# Altium schematic sheet Analog.SchDoc
size A3
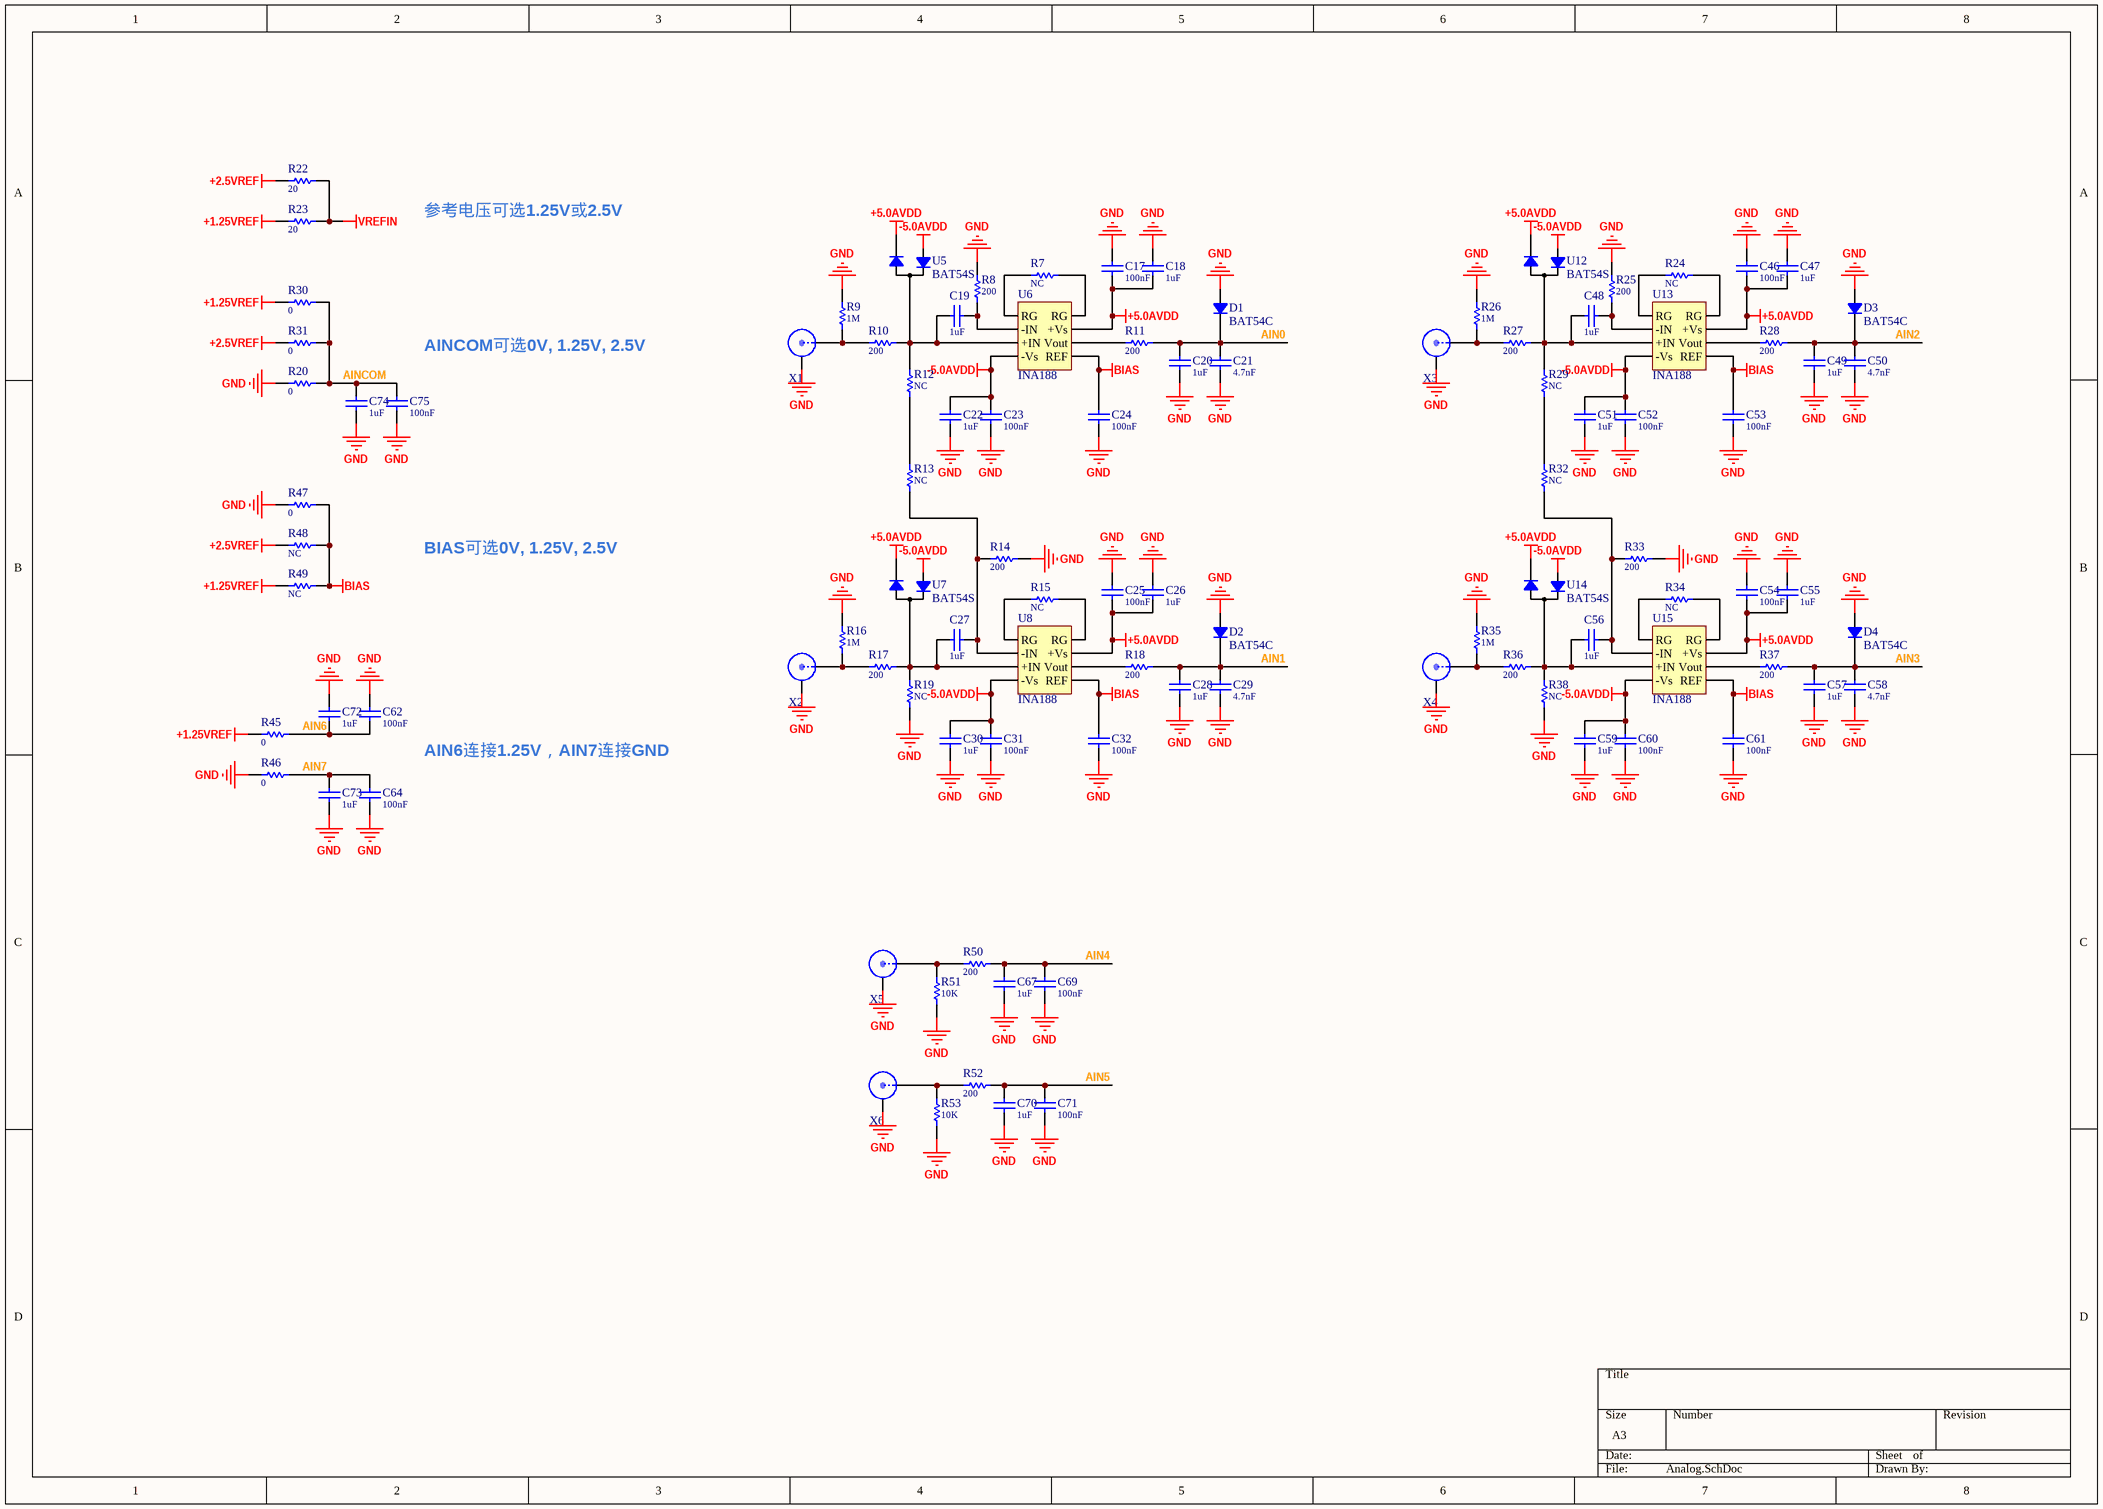
[diagram p0: Analog.SchDoc]

## Parts
C17  value 100nF  [C0402-L]  (hidden comment: Cap-S)
C18  value 1uF  [C0603-L]  (hidden comment: Cap-S)
C19  value 1uF  [C0603-L]  (hidden comment: Cap-S)
C20  value 1uF  [C0603-L]  (hidden comment: Cap-S)
C21  value 4.7nF  [C0402-L]  (hidden comment: Cap-S)
C22  value 1uF  [C0603-L]  (hidden comment: Cap-S)
C23  value 100nF  [C0402-L]  (hidden comment: Cap-S)
C24  value 100nF  [C0402-L]  (hidden comment: Cap-S)
C25  value 100nF  [C0402-L]  (hidden comment: Cap-S)
C26  value 1uF  [C0603-L]  (hidden comment: Cap-S)
C27  value 1uF  [C0603-L]  (hidden comment: Cap-S)
C28  value 1uF  [C0603-L]  (hidden comment: Cap-S)
C29  value 4.7nF  [C0402-L]  (hidden comment: Cap-S)
C30  value 1uF  [C0603-L]  (hidden comment: Cap-S)
C31  value 100nF  [C0402-L]  (hidden comment: Cap-S)
C32  value 100nF  [C0402-L]  (hidden comment: Cap-S)
C46  value 100nF  [C0402-L]  (hidden comment: Cap-S)
C47  value 1uF  [C0603-L]  (hidden comment: Cap-S)
C48  value 1uF  [C0603-L]  (hidden comment: Cap-S)
C49  value 1uF  [C0603-L]  (hidden comment: Cap-S)
C50  value 4.7nF  [C0402-L]  (hidden comment: Cap-S)
C51  value 1uF  [C0603-L]  (hidden comment: Cap-S)
C52  value 100nF  [C0402-L]  (hidden comment: Cap-S)
C53  value 100nF  [C0402-L]  (hidden comment: Cap-S)
C54  value 100nF  [C0402-L]  (hidden comment: Cap-S)
C55  value 1uF  [C0603-L]  (hidden comment: Cap-S)
C56  value 1uF  [C0603-L]  (hidden comment: Cap-S)
C57  value 1uF  [C0603-L]  (hidden comment: Cap-S)
C58  value 4.7nF  [C0402-L]  (hidden comment: Cap-S)
C59  value 1uF  [C0603-L]  (hidden comment: Cap-S)
C60  value 100nF  [C0402-L]  (hidden comment: Cap-S)
C61  value 100nF  [C0402-L]  (hidden comment: Cap-S)
C62  value 100nF  [C0402-L]  (hidden comment: Cap-S)
C64  value 100nF  [C0402-L]  (hidden comment: Cap-S)
C67  value 1uF  [C0603-L]  (hidden comment: Cap-S)
C69  value 100nF  [C0402-L]  (hidden comment: Cap-S)
C70  value 1uF  [C0603-L]  (hidden comment: Cap-S)
C71  value 100nF  [C0402-L]  (hidden comment: Cap-S)
C72  value 1uF  [C0603-L]  (hidden comment: Cap-S)
C73  value 1uF  [C0603-L]  (hidden comment: Cap-S)
C74  value 1uF  [C0603-L]  (hidden comment: Cap-S)
C75  value 100nF  [C0402-L]  (hidden comment: Cap-S)
D1  BAT54C  [SOT-23-2]
D2  BAT54C  [SOT-23-2]
D3  BAT54C  [SOT-23-2]
D4  BAT54C  [SOT-23-2]
R7  value NC  [R0603-L]  (hidden comment: R)
R8  value 200  [R0603-L]  (hidden comment: R)
R9  value 1M  [R0603-L]  (hidden comment: R)
R10  value 200  [R0603-L]  (hidden comment: R)
R11  value 200  [R0603-L]  (hidden comment: R)
R12  value NC  [R0603-L]  (hidden comment: R)
R13  value NC  [R0603-L]  (hidden comment: R)
R14  value 200  [R0603-L]  (hidden comment: R)
R15  value NC  [R0603-L]  (hidden comment: R)
R16  value 1M  [R0603-L]  (hidden comment: R)
R17  value 200  [R0603-L]  (hidden comment: R)
R18  value 200  [R0603-L]  (hidden comment: R)
R19  value NC  [R0603-L]  (hidden comment: R)
R20  value 0  [R0603-L]  (hidden comment: R)
R22  value 20  [R0603-L]  (hidden comment: R)
R23  value 20  [R0603-L]  (hidden comment: R)
R24  value NC  [R0603-L]  (hidden comment: R)
R25  value 200  [R0603-L]  (hidden comment: R)
R26  value 1M  [R0603-L]  (hidden comment: R)
R27  value 200  [R0603-L]  (hidden comment: R)
R28  value 200  [R0603-L]  (hidden comment: R)
R29  value NC  [R0603-L]  (hidden comment: R)
R30  value 0  [R0603-L]  (hidden comment: R)
R31  value 0  [R0603-L]  (hidden comment: R)
R32  value NC  [R0603-L]  (hidden comment: R)
R33  value 200  [R0603-L]  (hidden comment: R)
R34  value NC  [R0603-L]  (hidden comment: R)
R35  value 1M  [R0603-L]  (hidden comment: R)
R36  value 200  [R0603-L]  (hidden comment: R)
R37  value 200  [R0603-L]  (hidden comment: R)
R38  value NC  [R0603-L]  (hidden comment: R)
R45  value 0  [R0603-L]  (hidden comment: R)
R46  value 0  [R0603-L]  (hidden comment: R)
R47  value 0  [R0603-L]  (hidden comment: R)
R48  value NC  [R0603-L]  (hidden comment: R)
R49  value NC  [R0603-L]  (hidden comment: R)
R50  value 200  [R0603-L]  (hidden comment: R)
R51  value 10K  [R0603-L]  (hidden comment: R)
R52  value 200  [R0603-L]  (hidden comment: R)
R53  value 10K  [R0603-L]  (hidden comment: R)
U5  BAT54S  [SOT-23-3]
U6  INA188  [SOP-8]
U7  BAT54S  [SOT-23-3]
U8  INA188  [SOP-8]
U12  BAT54S  [SOT-23-3]
U13  INA188  [SOP-8]
U14  BAT54S  [SOT-23-3]
U15  INA188  [SOP-8]
X1  SMA  [SMA_ANGLE]  (value not drawn)
X2  SMA  [SMA_ANGLE]  (value not drawn)
X3  SMA  [SMA_ANGLE]  (value not drawn)
X4  SMA  [SMA_ANGLE]  (value not drawn)
X5  SMA  [SMA_ANGLE]  (value not drawn)
X6  SMA  [SMA_ANGLE]  (value not drawn)

## Nets
+1.25VREF: R23.1 R30.2 R45.2 R49.2
+2.5VREF: R22.1 R31.2 R48.2
+5.0AVDD: C17.2 C18.2 C25.2 C26.2 C46.2 C47.2 C54.2 C55.2 U5.3 U6.7(+Vs) U7.3 U8.7(+Vs) U12.3 U13.7(+Vs) U14.3 U15.7(+Vs)
-5.0AVDD: C22.1 C23.2 C30.1 C31.2 C51.1 C52.2 C59.1 C60.2 U5.1 U6.4(-Vs) U7.1 U8.4(-Vs) U12.1 U13.4(-Vs) U14.1 U15.4(-Vs)
BIAS: C24.2 C32.2 C53.2 C61.2 R47.1 R48.1 R49.1 U6.5(REF) U8.5(REF) U13.5(REF) U15.5(REF)
GND: C17.1 C18.1 C20.2 C21.2 C22.2 C23.1 C24.1 C25.1 C26.1 C28.2 C29.2 C30.2 C31.1 C32.1 C46.1 C47.1 C49.2 C50.2 C51.2 C52.1 C53.1 C54.1 C55.1 C57.2 C58.2 C59.2 C60.1 C61.1 C62.1 C64.2 C67.1 C69.1 C70.1 C71.1 C72.2 C73.2 C74.2 C75.2 D1.1 D2.1 D3.1 D4.1 R8.2 R9.1 R14.1 R16.1 R19.1 R20.2 R25.2 R26.1 R33.1 R35.1 R38.1 R46.2 R47.2 R51.2 R53.2 X1.2 X2.2 X3.2 X4.2 X5.2 X6.2
VREFIN: R22.2 R23.2
AIN0: C20.1 C21.1 D1.2 R11.1
AIN1: C28.1 C29.1 D2.2 R18.1
AIN2: C49.1 C50.1 D3.2 R28.1
AIN3: C57.1 C58.1 D4.2 R37.1
AIN4: C67.2 C69.2 R50.1
AIN5: C70.2 C71.2 R52.1
AIN6: C62.2 C72.1 R45.1
AIN7: C64.1 C73.1 R46.1
AINCOM: C74.1 C75.1 R20.1 R30.1 R31.1
NetC19_1: C19.1 R8.1 U6.2(-IN)
NetC19_2: C19.2 R10.1 R12.1 U5.2 U6.3(+IN)
NetC27_1: C27.1 R13.2 R14.2 U8.2(-IN)
NetC27_2: C27.2 R17.1 R19.2 U7.2 U8.3(+IN)
NetC48_1: C48.1 R25.1 U13.2(-IN)
NetC48_2: C48.2 R27.1 R29.1 U12.2 U13.3(+IN)
NetC56_1: C56.1 R32.2 R33.2 U15.2(-IN)
NetC56_2: C56.2 R36.1 R38.2 U14.2 U15.3(+IN)
NetR7_1: R7.1 U6.8(RG)
NetR7_2: R7.2 U6.1(RG)
NetR9_2: R9.2 R10.2 X1.1
NetR11_2: R11.2 U6.6(Vout)
NetR12_2: R12.2 R13.1
NetR15_1: R15.1 U8.8(RG)
NetR15_2: R15.2 U8.1(RG)
NetR16_2: R16.2 R17.2 X2.1
NetR18_2: R18.2 U8.6(Vout)
NetR24_1: R24.1 U13.8(RG)
NetR24_2: R24.2 U13.1(RG)
NetR26_2: R26.2 R27.2 X3.1
NetR28_2: R28.2 U13.6(Vout)
NetR29_2: R29.2 R32.1
NetR34_1: R34.1 U15.8(RG)
NetR34_2: R34.2 U15.1(RG)
NetR35_2: R35.2 R36.2 X4.1
NetR37_2: R37.2 U15.6(Vout)
NetR50_2: R50.2 R51.1 X5.1
NetR52_2: R52.2 R53.1 X6.1

## Notes on the sheet
- 参考电压可选1.25V或2.5V
- (near C75) AINCOM可选0V, 1.25V, 2.5V
- BIAS可选0V, 1.25V, 2.5V
- AIN6连接1.25V，AIN7连接GND

## Library data of the parts
C17-C32 C46-C62 C64 C67 C69-C75 = Cap-S: 贴片瓷片电容
R7-R20 R22-R38 R45-R53 = Res: 贴片电阻
U6 U8 U13 U15 = InAmp